# EAGLE design Clock (EAGLE 9.5.1)
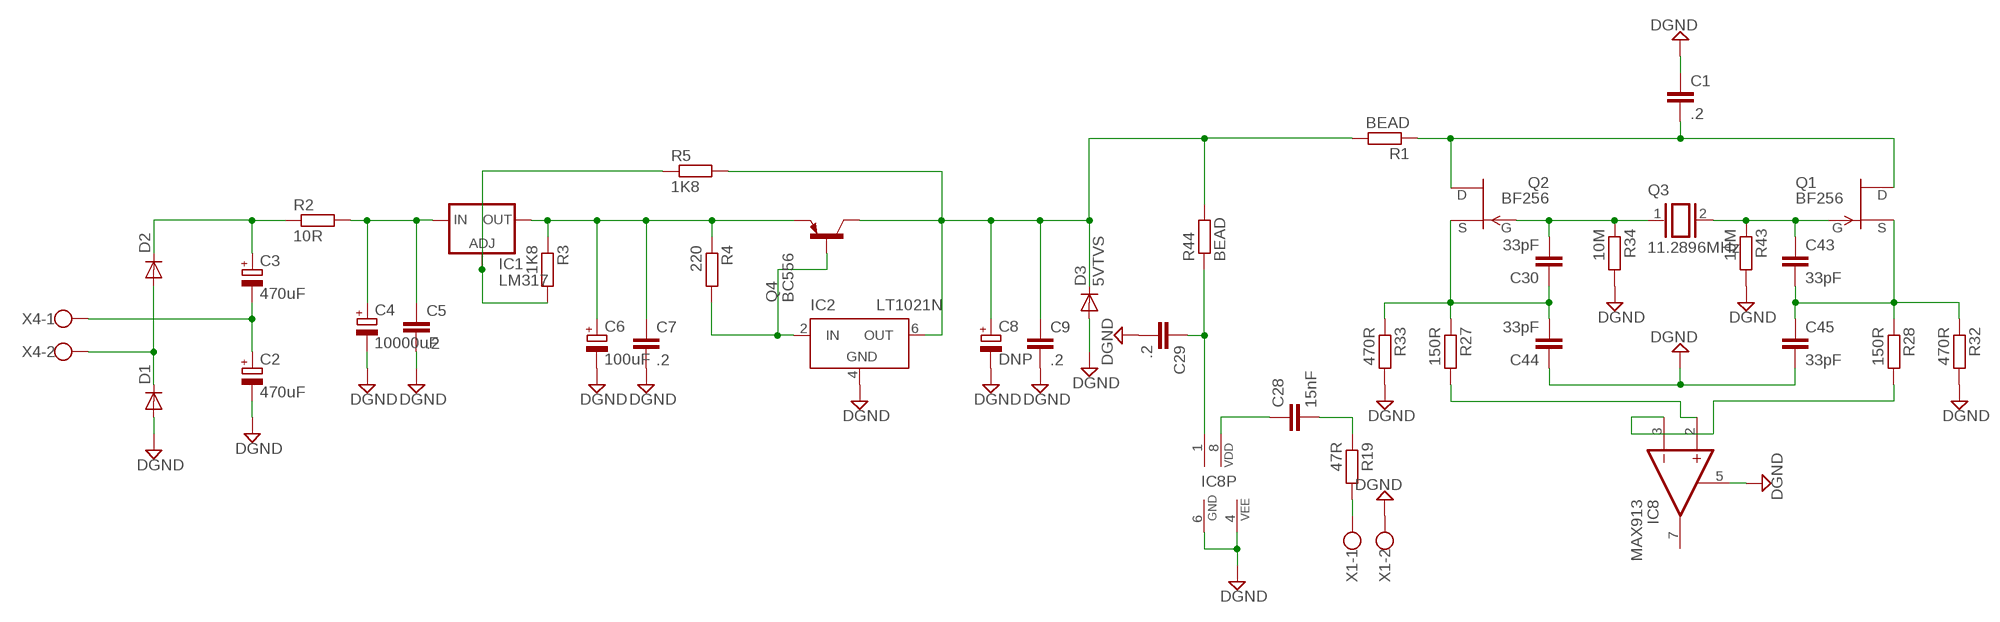
[diagram p0: schematic, sheet 1]

## Parts
C1  .2  C-EUC1210K  [C1210K]
C2  470uF  CPOL-EUE5-10.5  [E5-10,5]
C3  470uF  CPOL-EUE5-10.5  [E5-10,5]
C4  10000uF  CPOL-EUE7.5-16  [E7,5-16]
C5  .2  C-EUC1210K  [C1210K]
C6  100uF  CPOL-EUE3.5-8  [E3,5-8]
C7  .2  C-EUC1210K  [C1210K]
C8  DNP  CPOL-EUE3.5-8  [E3,5-8]
C9  .2  C-EUC1210K  [C1210K]
C28  15nF  C-EU050-055X075  [C050-055X075]
C29  .2  C-EUC1210K  [C1210K]
C30  33pF  C-EU050-030X075  [C050-030X075]
C43  33pF  C-EU050-030X075  [C050-030X075]
C44  33pF  C-EU050-030X075  [C050-030X075]
C45  33pF  C-EU050-030X075  [C050-030X075]
D1  1N4148DO35-7  [DO35-7]
D2  1N4148DO35-7  [DO35-7]
D3  5VTVS  A114  [DO204-10]
IC1  LM317  LM317TS  [317TS]
IC2  LT1021N  [DIL08]
IC8  MAX913  MAX903CPA  [DIL08]
Q1  BF256  2N5484  [TO92-]
Q2  BF256  2N5484  [TO92-]
Q3  11.2896MHz  XTAL/S  [QS]
Q4  BC556  [TO92-EBC]
R1  BEAD  R-EU_R1210  [R1210]
R2  10R  R-EU_0207/10  [0207/10]
R3  1K8  R-EU_0204/7  [0204/7]
R4  220  R-EU_0204/7  [0204/7]
R5  1K8  R-EU_0204/7  [0204/7]
R19  47R  R-EU_R1210  [R1210]
R27  150R  R-EU_0204/7  [0204/7]
R28  150R  R-EU_0204/7  [0204/7]
R32  470R  R-EU_0204/7  [0204/7]
R33  470R  R-EU_0204/7  [0204/7]
R34  10M  R-EU_0204/7  [0204/7]
R43  10M  R-EU_0204/7  [0204/7]
R44  BEAD  R-EU_R1210  [R1210]
X1  W237-02P  [W237-132]
X4  W237-02P  [W237-132]

## Nets
DGND: C1.1 C2.- C4.- C5.2 C6.- C7.2 C8.- C9.2 C29.2 C44.1 C45.2 D1.A D3.A IC2.4(GND) IC8.4(VEE) IC8.5(LATCH) IC8.6(GND) R32.2 R33.2 R34.2 R43.2 X1.2
N$1: C29.1 IC8.1(VCC) R44.1
N$3: C2.+ C3.- X4.1
N$5: C4.+ C5.1 IC1.3(IN) R2.2
N$6: C3.+ D2.C R2.1
N$7: D1.C D2.A X4.2
N$8: C6.+ C7.1 IC1.2(OUT) Q4.E R3.1 R4.1
N$9: IC1.1(ADJ) R3.2 R5.1
N$10: IC2.2(IN) Q4.B R4.2
N$12: C8.+ C9.1 D3.C IC2.6(OUT) Q4.C R1.2 R5.2 R44.2
N$68: R19.2 X1.1
N$69: C28.1 IC8.8(VDD)
N$72: C28.2 R19.1
N$73: C30.1 C44.2 Q2.2(S) R27.1 R33.1
N$75: IC8.2(+IN) R27.2
N$81: IC8.3(-IN) R28.2
N$83: C1.2 Q1.3(D) Q2.3(D) R1.1
N$86: C43.2 C45.1 Q1.2(S) R28.1 R32.1
N$87: C30.2 Q2.1(G) Q3.1 R34.1
N$88: C43.1 Q1.1(G) Q3.2 R43.1
Unconnected: IC8.7(OUT)

## Library data of the parts
C1 C5 C7 C9 C28-C30 C43-C45 = resistor:C-EU: CAPACITOR, European symbol
C2-C4 C6 C8 = resistor:CPOL-EU: POLARIZED CAPACITOR, European symbol
D1 D2 = diode:1N4148: DIODE high speed (Philips)
D3 = diode:A114: DIODE germanium
IC1 = v-reg:LM317TS: VOLTAGE REGULATOR
IC2 = linear-technology:LT1021: Precision Reference Source: http://www.linear.com/pc/downloadDocument.do?navId=H0,C1,C1010,C1603,P1229,D2805
IC8 = maxim:MAX903CPA: VOLTAGE COMPARATOR
Q1 Q2 = transistor-fet:?548*: N-Channel JFETs Source: VISHAY 2N5484.pdf Compatible: TO92 2N5245 J304 J305 U310 J308 J309 J310 TO72 2N4416 2N4416A 2N3823 2N4351 3N169 3N170 3N171 MFE3002 TO18 2N3796 2N3797 MFE825 Source: Motorola European Master Guide Pacge 3-59
Q3 = special:XTAL/S: CRYSTAL
Q4 = transistor-pnp:BC556*: PNP Transistror
R1-R5 R19 R27 R28 R32-R34 R43 R44 = resistor:R-EU_: RESISTOR, European symbol
X1 X4 = con-wago-508:W237-02P: WAGO SREW CLAMP

## Board
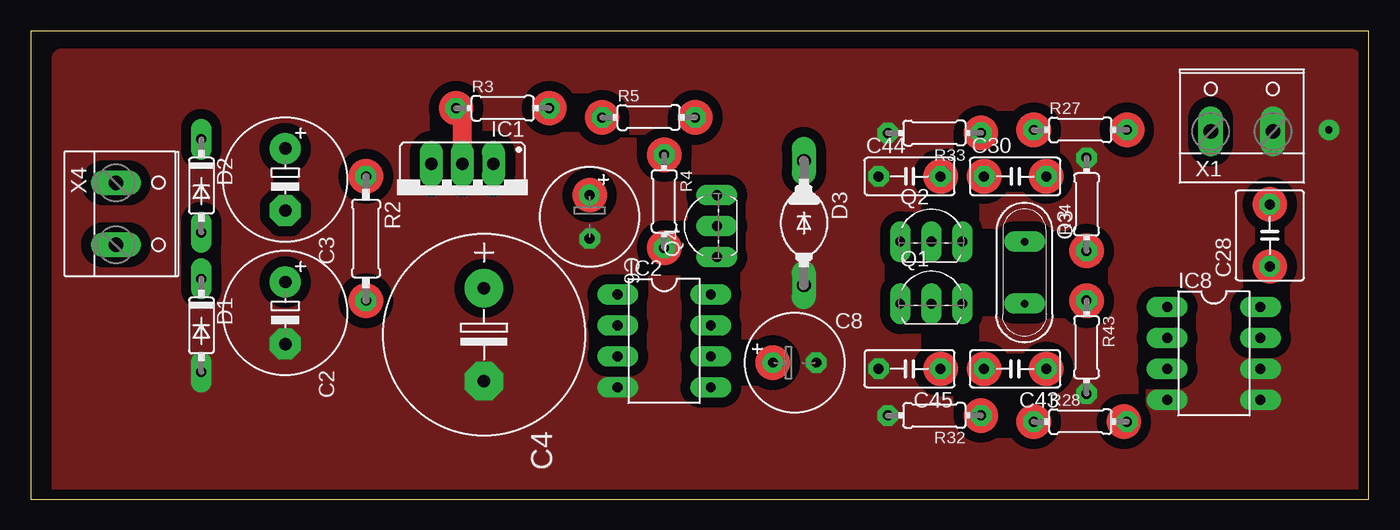
[diagram p1: board, top side]
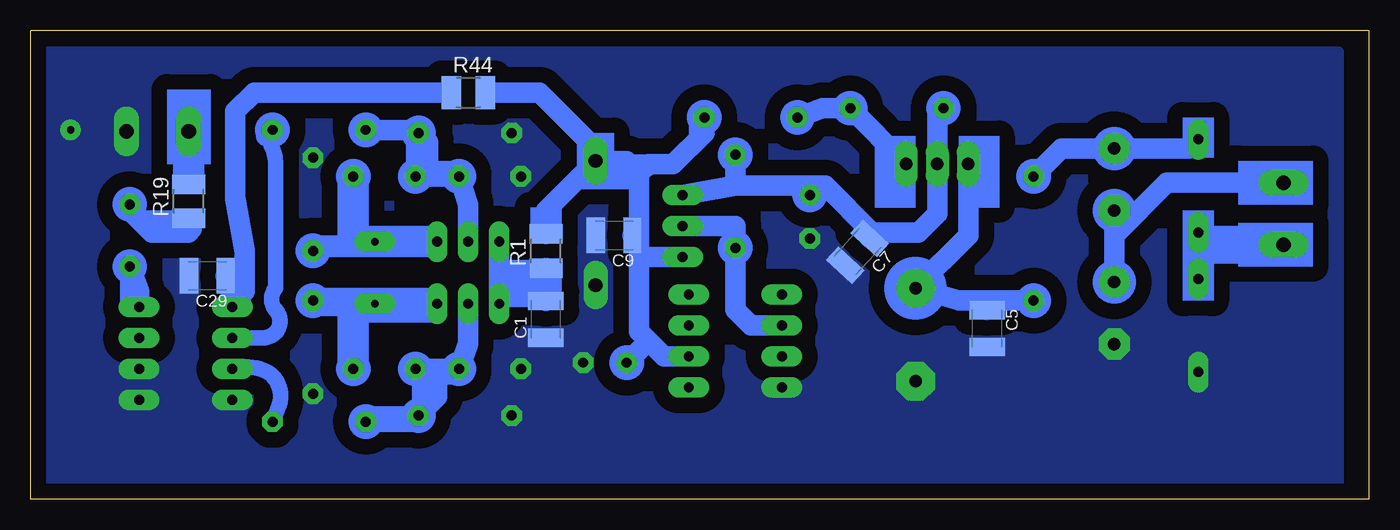
[diagram p2: board, bottom side, seen from below]

Size 109.45 x 38.35 mm. Coordinates in mm from the lower left corner, seen from the top.
Outline: 109.45,38.35 109.45,0 0,0 0,38.35 109.45,38.35
Copper layers (1*16): Top 0.035mm / dielectric 1.5mm / Bottom 0.035mm
Design rules "default *": minimum track width 10mil, minimum drill 24mil, track to track 8mil, track to pad 8mil, pad to pad 8mil, via to via 8mil, smd to smd 8mil, copper to edge 30mil, drill to drill 8mil, minimum pad ring 17mil, minimum via ring 8mil, stop-mask expansion 4mil, vias tented up to drill 0mil, thermal gap 10mil

### Footprints (pad centres in the part's own frame; a part is rotated, then mirrored left to right if it is on the bottom)
C1210K = smd 1.5 x 2.9: 1 -1.5,0; 2 1.5,0
E5-10,5 = drill 1.016 pad 2.54: + -2.54,0 | drill 1.016 pad 2.54 octagon: - 2.54,0
E7,5-16 = drill 1.016 pad 3.15: + -3.81,0 | drill 1.016 pad 3.15 octagon: - 3.81,0
E3,5-8 = drill 0.813 pad 1.6: + -1.778,0 | drill 0.813 pad 1.6 octagon: - 1.778,0
C050-055X075 = drill 0.813 octagon: 1 -2.54,0; 2 2.54,0
C050-030X075 = drill 0.813 octagon: 1 -2.54,0; 2 2.54,0
DO35-7 = drill 0.813 long: A 3.81,0; C -3.81,0
DO204-10 = drill 1.118 long: A 5.08,0; C -5.08,0
317TS = drill 1.016 long: 1 -2.54,-2.54; 2 0,-2.54; 3 2.54,-2.54
DIL08 = drill 0.813 pad 1.676 long: 1 -3.81,-3.81; 2 -1.27,-3.81; 3 1.27,-3.81; 4 3.81,-3.81; 5 3.81,3.81; 6 1.27,3.81; 7 -1.27,3.81; 8 -3.81,3.81
DIL08' = drill 0.813 long: 1 -3.81,-3.81; 2 -1.27,-3.81; 3 1.27,-3.81; 4 3.81,-3.81; 5 3.81,3.81; 6 1.27,3.81; 7 -1.27,3.81; 8 -3.81,3.81
TO92- = drill 0.813 long: 1 2.54,0; 2 0,0; 3 -2.54,0
QS = drill 0.61 pad 1.676 long: 1 -2.54,0; 2 2.54,0
TO92-EBC = drill 0.813 long: B 0,-1.27; C -2.54,-1.27; E 2.54,-1.27
R1210 = smd 1.6 x 2.7: 1 -1.4,0; 2 1.4,0
0207/10 = drill 0.813 octagon: 1 -5.08,0; 2 5.08,0
0204/7 = drill 0.813 octagon: 1 -3.81,0; 2 3.81,0
W237-132 = drill 1.194 long: 1 -2.54,-0.635; 2 2.54,-0.635

### Placement (x,y rotation side)
C1  67.31,14.73 90 bottom
C2  20.83,15.24 270 top
C3  20.83,26.16 270 top
C4  37.08,13.46 270 top
C5  31.24,13.97 270 bottom
C6  45.72,23.11 270.3 top
C7  41.82,20.26 227.7 bottom
C8  62.48,11.18 0 top
C9  61.72,21.59 180 bottom
C28  101.35,21.59 90 top
C29  95,18.29 180 bottom
C30  80.52,26.42 0 top
C43  80.52,10.67 180 top
C44  71.88,26.42 0 top
C45  71.88,10.67 180 top
D1  13.97,14.22 270 top
D2  13.97,25.65 270 top
D3  63.25,22.61 270 top
IC1  35.31,24.89 180 top
IC2  51.82,12.95 270 top
IC8  MAX913  [DIL08']  96.77,11.94 270 top
Q1  73.66,16 0 top
Q2  73.66,21.08 0 top
Q3  81.28,18.54 270 top
Q4  54.86,22.35 90 top
R1  67.31,20.32 90 bottom
R2  27.43,21.34 270 top
R3  38.61,32 0 top
R4  51.82,24.38 270 top
R5  50.55,31.24 0 top
R19  96.52,24.38 89.9 bottom
R27  85.85,30.23 0 top
R28  85.85,6.35 0 top
R32  73.91,6.86 180 top
R33  73.91,29.97 180 top
R34  86.36,24.13 90 top
R43  86.36,12.45 270 top
R44  73.66,33.27 0 bottom
X1  99.06,30.73 0 top
X4  7.62,23.37 270 top

### Tracks (layer width: path | path; a pad name or v marks a point on that pad's centre or on a via)
DGND  (via drill 0.6 pad 1.68)
  other vias: 106.17,30.23
  pour Bottom (isolate 1.27, rank 5, no thermals): 2.54,36.58 2.54,1.27 108.2,1.27 108.2,36.58
  pour Top (isolate 0.813, no thermals): 2.54,36.07 107.95,36.07 107.95,0.51 2.54,0.51
N$1
  Bottom 1.676: R44.1 91.19,33.27 92.71,31.75 92.71,24.64 91.95,20.32 91.95,17.02 92.59,16.21 | 92.59,16.21 IC8.1 | C29.1 92.96,16.51 92.59,16.21
N$3
  Bottom 1.676: X4.1 16.51,25.91 20.83,21.59 | 20.83,21.59 C2.+ | 20.83,21.59 C3.-
N$5
  Bottom 1.676: R2.2 31.24,16.26 | 31.24,16.26 33.53,16.26 C4.+ 32.77,21.59 IC1.3 | 31.24,16.26 C5.1
N$6
  Bottom 1.676: D2.C 14.73,28.7 C3.+ 25.15,28.7 R2.1
N$7
  Bottom 1.676: X4.2 13.97,20.83 | 13.97,20.83 D2.A | 13.97,20.83 D1.C
N$8
  Bottom 1.676: R3.1 35.31,31.5 IC1.2 35.31,23.37 36.83,21.84 39.12,21.84 40.34,21.84 | 51.82,25.65 R4.1 | 51.82,25.65 Q4.E | 40.34,21.84 40.64,21.84 44.45,25.65 45.72,25.65 | 45.72,25.65 51.82,25.65 | C6.+ 45.72,25.65 | 40.34,21.84 C7.1
N$9
  Bottom 1.676: IC1.1 R3.2 44.7,32 R5.1
N$10
  Bottom 1.676: Q4.B 51.82,22.35 R4.2 51.82,15.49 50.55,14.22 IC2.2
N$12
  Bottom 1.676: IC2.6 57.66,11.68 58.8,12.83 | 55.63,19.81 Q4.C 59.69,19.81 | 59.69,19.81 59.69,13.72 58.8,12.83 | 59.69,19.81 59.69,21.34 | 59.69,21.34 59.69,26.67 | C8.+ 59.05,12.83 58.8,12.83 | C9.1 59.97,21.34 59.69,21.34 | D3.C 60.71,27.69 59.69,26.67 | R5.2 54.36,29.97 56.9,27.43 58.93,27.43 59.69,26.67 | R1.2 67.31,23.62 D3.C | R44.2 67.82,33.27 63.25,28.7 D3.C
N$68
  Bottom 1.676: X1.1 R19.2
N$69
  Bottom 1.676: IC8.8 100.58,17.02 C28.1
N$72
  Bottom 1.676: C28.2 101.35,23.62 99.57,21.84 96.52,21.84 96.27,22.1 96.27,22.73 R19.1
N$73
  Bottom 1.676: 76.96,26.42 C44.2 73.66,24.13 Q2.2 | 76.96,26.42 C30.1 | 76.96,26.42 76.96,29.21 R33.1 77.98,30.23 R27.1
N$75
  Bottom 1.27: IC8.2 90.42,13.21 arc-132 89.41,15.49 arc84 89.41,17.27 89.41,27.18 arc-33 90.17,29.72
  Bottom 1.676: 90.17,29.72 R27.2
N$81
  Bottom 1.27: R28.2 89.15,7.62 arc-97 90.68,10.67 arc-30 IC8.3
N$83
  Bottom 1.676: 71.12,17.53 Q1.3 | 71.12,17.53 Q2.3 | C1.2 67.31,17.53 | 67.31,17.53 R1.1 | 67.31,17.53 71.12,17.53
N$86
  Bottom 1.676: 75.95,10.67 C43.2 | Q1.2 73.66,12.7 C45.1 75.95,10.67 | 75.95,10.67 76.2,10.41 76.2,8.38 R32.1 78.23,6.35 R28.1
N$87
  Bottom 1.676: 83.06,21.08 R34.1 | 83.06,21.08 Q3.1 Q2.1 | 83.06,21.08 C30.2
N$88
  Bottom 1.676: 83.06,16 R43.1 | 83.06,16 Q3.2 Q1.1 | 83.06,16 C43.1
(copper drawn outside any net)
  shapes: Bottom area x49, Bottom circle x29, Top area x2, Top circle x26